# Altium schematic sheet ST_LINK_V2-1.SCHDOC: ST-LINK/V2-1 with support of SWD only
size A4; Date: 01-DEC-2013; Author: A.B; CompanyName: STMicroelectronics; Organization: Microcontrollers Division; Address1: 12, Rue Jules HOROWITZ; Address2: 38019 Grenoble; Address3: FRANCE; DocumentNumber: MB1184; Revision: C-01; SheetNumber: 2; SheetTotal: 10; Project: STM32L476G-DISCO
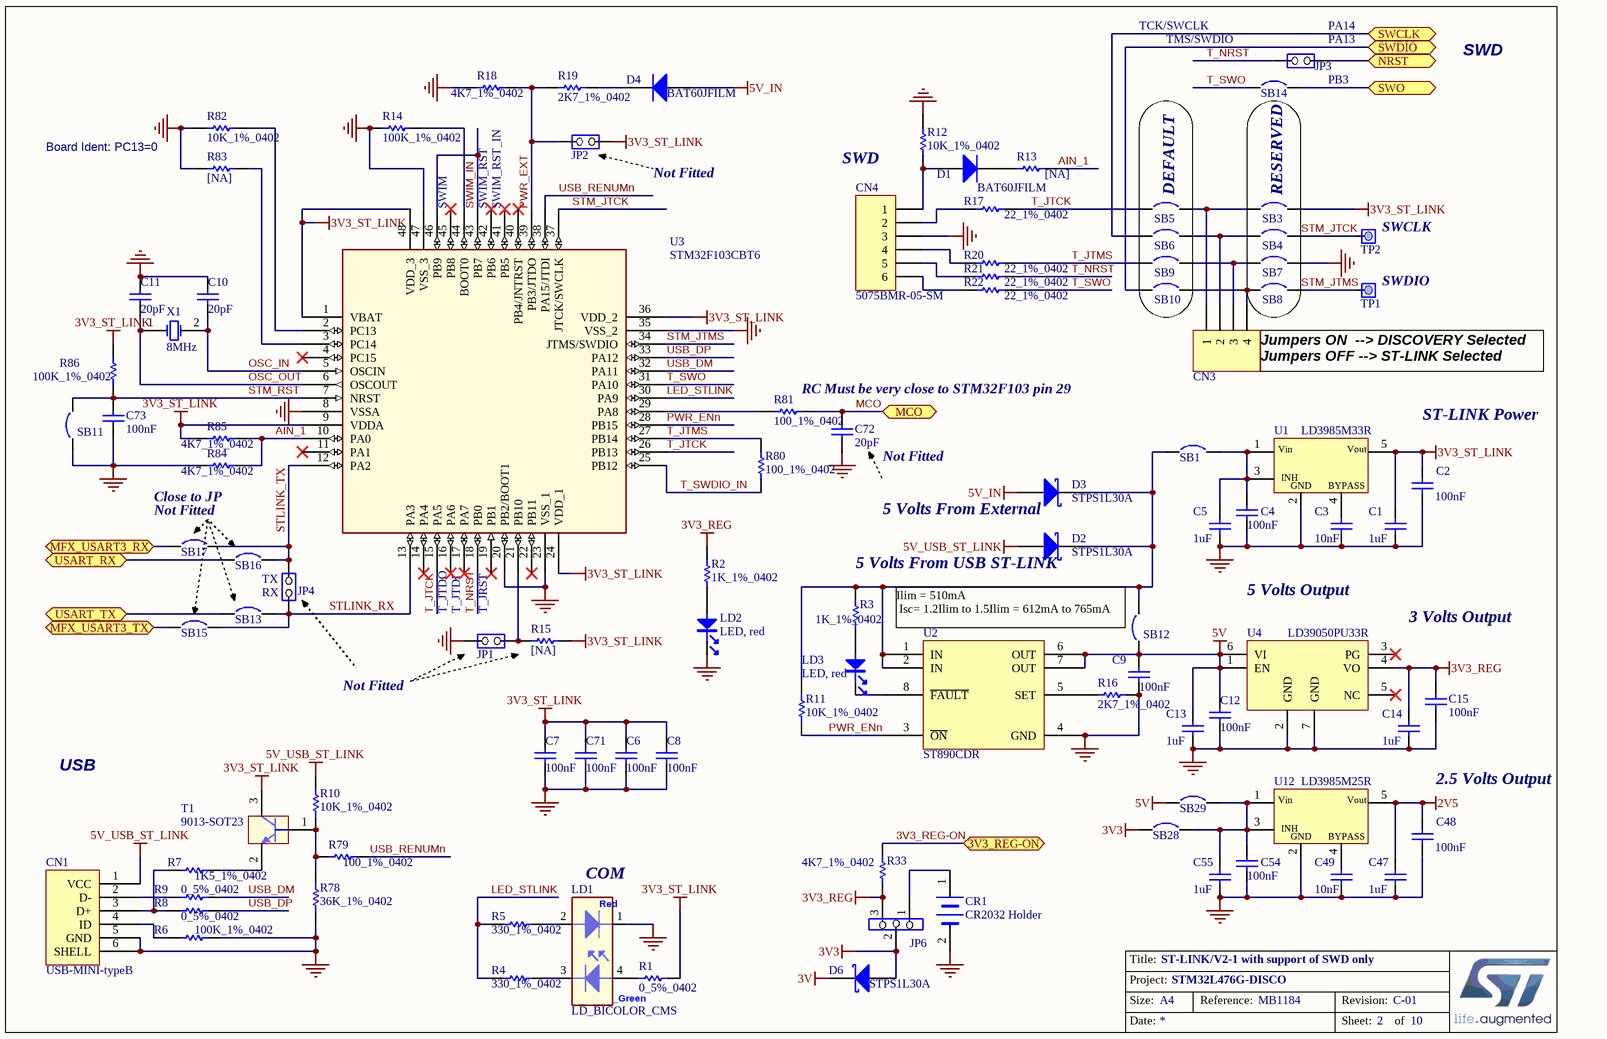
[diagram p0: ST_LINK_V2-1.SCHDOC]

## Parts
C1  1uF  [0603C]
C2  100nF  [0402C]
C3  10nF  [0603C]
C4  100nF  [0402C]
C5  1uF  [0603C]
C6  100nF  [0402C]
C7  100nF  [0402C]
C8  100nF  [0402C]
C9  100nF  [0402C]
C10  20pF  [0402C]
C11  20pF  [0402C]
C12  100nF  [0402C]
C13  1uF  [0603C]
C14  1uF  [0603C]
C15  100nF  [0402C]
C47  1uF  [0603C]
C48  100nF  [0402C]
C49  10nF  [0603C]
C54  100nF  [0402C]
C55  1uF  [0603C]
C71  100nF  [0402C]
C72  20pF  [0402C]
C73  100nF  [0402C]
CN1  USB-MINI-typeB  [USB-MINI-B-SMD]
CN3  Header 4  [Header 4]  (value not drawn)
CN4  5075BMR-05-SM  [HDR1X6]
CR1  CR2032 Holder  [CR2032/SMT]
D1  BAT60JFILM  [SOD323/A]
D2  STPS1L30A  [SMA]
D3  STPS1L30A  [SMA]
D4  BAT60JFILM  [SOD323/A]
D6  STPS1L30A  [SMA]
JP1  Jumper 2 pins  [SIP2/2.54]  (value not drawn)
JP2  Jumper 2 pins  [SIP2/2.54]  (value not drawn)
JP3  Jumper 2 pins  [SIP2/2.54]  (value not drawn)
JP4  Jumper 2 pins  [SIP2/2.54]  (value not drawn)
JP6  Jumper 3 pins  [SIP3]  (value not drawn)
LD1  LD_BICOLOR_CMS  [HSMF-A201]
LD2  LED, red  [0603D]
LD3  LED, red  [0603D]
R1  0_5%_0402  [0402R]
R2  1K_1%_0402  [0402R]
R3  1K_1%_0402  [0402R]
R4  330_1%_0402  [0402R]
R5  330_1%_0402  [0402R]
R6  100K_1%_0402  [0402R]
R7  1K5_1%_0402  [0402R]
R8  0_5%_0402  [0402R]
R9  0_5%_0402  [0402R]
R10  10K_1%_0402  [0402R]
R11  10K_1%_0402  [0402R]
R12  10K_1%_0402  [0402R]
R13  [NA]  [0402R]
R14  100K_1%_0402  [0402R]
R15  [NA]  [0402R]
R16  2K7_1%_0402  [0402R]
R17  22_1%_0402  [0402R]
R18  4K7_1%_0402  [0402R]
R19  2K7_1%_0402  [0402R]
R20  22_1%_0402  [0402R]
R21  22_1%_0402  [0402R]
R22  22_1%_0402  [0402R]
R33  4K7_1%_0402  [0402R]
R78  36K_1%_0402  [0402R]
R79  100_1%_0402  [0402R]
R80  100_1%_0402  [0402R]
R81  100_1%_0402  [0402R]
R82  10K_1%_0402  [0402R]
R83  [NA]  [0402R]
R84  4K7_1%_0402  [0402R]
R85  4K7_1%_0402  [0402R]
R86  100K_1%_0402  [0402R]
SB1  Circuit Breaker  [JP2_SMD]  (value not drawn)
SB3  Circuit Breaker  [JP2_SMD]  (value not drawn)
SB4  Circuit Breaker  [JP2_SMD]  (value not drawn)
SB5  Circuit Breaker  [JP2_SMD]  (value not drawn)
SB6  Circuit Breaker  [JP2_SMD]  (value not drawn)
SB7  Circuit Breaker  [JP2_SMD]  (value not drawn)
SB8  Circuit Breaker  [JP2_SMD]  (value not drawn)
SB9  Circuit Breaker  [JP2_SMD]  (value not drawn)
SB10  Circuit Breaker  [JP2_SMD]  (value not drawn)
SB11  Circuit Breaker  [JP2_SMD]  (value not drawn)
SB12  Circuit Breaker  [JP2_SMD]  (value not drawn)
SB13  Circuit Breaker  [JP2_SMD]  (value not drawn)
SB14  Circuit Breaker  [JP2_SMD]  (value not drawn)
SB15  Circuit Breaker  [JP2_SMD]  (value not drawn)
SB16  Circuit Breaker  [JP2_SMD]  (value not drawn)
SB17  Circuit Breaker  [JP2_SMD]  (value not drawn)
SB28  Circuit Breaker  [JP2_SMD]  (value not drawn)
SB29  Circuit Breaker  [JP2_SMD]  (value not drawn)
T1  9013-SOT23  [SOT23]
TP1  Test point 1 pin with hole  [SIP1/2.54]  (value not drawn)
TP2  Test point 1 pin with hole  [SIP1/2.54]  (value not drawn)
U1  LD3985M33R  [SOT-23-5L]
U2  ST890CDR  [SO-8]
U3  STM32F103CBT6  [QFP48 7x7]
U4  LD39050PU33R  [DFN6_3x3]
U12  LD3985M25R  [SOT-23-5L]
X1  8MHz  [XTAL1]

## Blocks framed on the sheet
DEFAULT: SB5 SB6 SB9 SB10
RESERVED: SB3 SB4 SB7 SB8

## Ports
3V3_REG-ON, MCO, MFX_USART3_RX, MFX_USART3_TX, NRST, SWCLK, SWDIO, SWO, USART_RX, USART_TX

## Nets
2V5: C47.1 C48.2 U12.5(Vout)
3V: D6.2(K)
3V3: D6.1(A) JP6.2 SB28.1
3V3_REG: C14.2 C15.2 JP6.3 R2.2 R33.1 U4.4(VO)
3V3_ST_LINK: C1.1 C2.2 C6.1 C7.2 C8.2 C71.2 JP2.2(NO) R1.2 R15.2 R85.1 R86.2 SB3.2 T1.3(C) U1.5(Vout) U3.1(VBAT) U3.9(VDDA) U3.24(VDD_1) U3.36(VDD_2) U3.48(VDD_3)
5V: C9.2 C12.2 C13.2 SB12.1 SB29.1 U2.6(OUT) U2.7(OUT) U4.1(EN) U4.6(VI)
5V_IN: D3.1(A) D4.1(A)
5V_USB_ST_LINK: CN1.1(VCC) D2.1(A) R10.2
GND: C1.2 C2.1 C3.1 C4.1 C5.1 C6.2 C7.1 C8.1 C9.1 C10.1 C11.1 C12.1 C13.1 C14.1 C15.1 C47.2 C48.1 C49.1 C54.1 C55.1 C71.1 C72.2 C73.1 CN1.5(GND) CN1.6(SHELL) CN4.3 CR1.2(-) JP1.1(COMMON) LD1.1 LD2.2 R6.2 R12.2 R14.1 R16.2 R18.1 R78.1 R82.1 R83.1 R84.1 SB7.2 SB11.1 U1.2(GND) U2.4(GND) U3.8(VSSA) U3.20(PB2/BOOT1) U3.23(VSS_1) U3.35(VSS_2) U3.47(VSS_3) U4.2(GND) U4.7(GND) U12.2(GND)
3V3_REG-ON: R33.2 ; port 3V3_REG-ON
AIN_1: R13.2 R84.2 R85.2 U3.10(PA0)
LED_STLINK: R4.1 R5.1 U3.30(PA9)
MCO: C72.1 R81.2 ; port MCO
MFX_USART3_RX: SB17.1 ; port MFX_USART3_RX
MFX_USART3_TX: SB15.1 ; port MFX_USART3_TX
NRST: JP3.2(NO) ; port NRST
OSC_IN: C10.2 U3.5(OSCIN) X1.2(OSC2)
OSC_OUT: C11.2 U3.6(OSCOUT) X1.1(OSC1)
PWR_ENn: R11.1 U2.3(~{ON}) U3.28(PB15)
PWR_EXT: JP2.1(COMMON) R18.2 R19.1 U3.39(PB3/JTDO)
STLINK_RX: JP4.1(COMMON) SB13.2 SB15.2 U3.13(PA3)
STLINK_TX: JP4.2(NO) SB16.2 SB17.2 U3.12(PA2)
STM_JTCK: SB4.2 TP2.1(COMMON) U3.37(JTCK/SWCLK)
STM_JTMS: SB8.2 TP1.1(COMMON) U3.34(JTMS/SWDIO)
STM_RST: C73.2 R86.1 SB11.2 U3.7(NRST)
SWCLK: SB6.1 ; port SWCLK
SWDIO: SB10.1 ; port SWDIO
SWIM_IN: U3.43(PB7) U3.46(PB9)
SWO: SB14.2 ; port SWO
T_JTCK: R17.2 SB5.1 U3.15(PA5) U3.26(PB13)
T_JTMS: R20.2 R80.2 SB9.1 U3.27(PB14)
T_NRST: JP3.1(COMMON) R21.2 U3.18(PB0)
T_SWDIO_IN: R80.1 U3.25(PB12)
T_SWO: R22.2 SB14.1 U3.31(PA10)
USART_RX: SB16.1 ; port USART_RX
USART_TX: SB13.1 ; port USART_TX
USB_DM: R9.2 U3.32(PA11)
USB_DP: R8.2 U3.33(PA12)
USB_RENUMn: R79.2 U3.38(PA15/JTDI)
NetC3_2: C3.2 U1.4(BYPASS)
NetC4_2: C4.2 C5.2 SB1.2 U1.1(Vin) U1.3(CE)
NetC49_2: C49.2 U12.4(BYPASS)
NetC54_2: C54.2 C55.2 SB28.2 SB29.2 U12.1(Vin) U12.3(CE)
NetCN1_2: CN1.2(D-) R9.1
NetCN1_3: CN1.3(D+) R7.1 R8.1
NetCN1_4: CN1.4(ID) R6.1
NetCN3_1: CN3.1 SB3.1 SB5.2
NetCN3_2: CN3.2 SB4.1 SB6.2
NetCN3_3: CN3.3 SB7.1 SB9.2
NetCN3_4: CN3.4 SB8.1 SB10.2
NetCN4_1: CN4.1 D1.1(A) R12.1
NetCN4_2: CN4.2 R17.1
NetCN4_4: CN4.4 R20.1
NetCN4_5: CN4.5 R21.1
NetCN4_6: CN4.6 R22.1
NetCR1_1: CR1.1(+) JP6.1
NetD1_2: D1.2(K) R13.1
NetD2_2: D2.2(K) D3.2(K) R3.2 R11.2 SB1.1 SB12.2 U2.1(IN) U2.2(IN)
NetD4_2: D4.2(K) R19.2
NetJP1_2: JP1.2(NO) R15.1 U3.21(PB10)
NetLD1_2: LD1.2 R5.2
NetLD1_3: LD1.3 R4.2
NetLD1_4: LD1.4 R1.1
NetLD2_1: LD2.1 R2.1
NetLD3_1: LD3.1 R3.1
NetLD3_2: LD3.2 U2.8(~{FAULT})
NetR7_2: R7.2 T1.2(E)
NetR10_1: R10.1 R78.2 R79.1 T1.1(B)
NetR14_2: R14.2 U3.44(BOOT0)
NetR16_1: R16.1 U2.5(SET)
NetR81_1: R81.1 U3.29(PA8)
NetR82_2: R82.2 U3.2(PC13)
NetR83_2: R83.2 U3.3(PC14)

Not connected (* = marked no-connect by the designer): U3 4(PC15)* 11(PA1)* 14(PA4)* 16(PA6)* 17(PA7)* 19(PB1)* 22(PB11)* 40(PB4/JNTRST)* 41(PB5)* 42(PB6)* 45(PB8)*; U4 3(PG)* 5(NC)*

## Notes on the sheet
- TCK/SWCLK
- TMS/SWDIO
- (near JP3) PA14
- (near JP3) PA13
- PB3
- SWD
- Board Ident: PC13=0
- Not Fitted
- SWIM
- (near U3) SWIM_RST
- SWIM_RST_IN
- (near TP2) SWCLK
- (near TP1) SWDIO
- (near CN3) Jumpers ON  --> DISCOVERY Selected
  Jumpers OFF --> ST-LINK Selected
- (near R81) RC Must be very close to STM32F103 pin 29
- ST-LINK Power
- Close to JP
- (near C72) Not Fitted
- (near D3) 5 Volts From External
- TX
- (near D2) 5 Volts From USB ST-LINK
- RX
- T_JTDO
- T_JTDI
- T_JRST
- (near SB12) Ilim = 510mA
  Isc= 1.2Ilim to 1.5Ilim = 612mA to 765mA
- 5 Volts Output
- 3 Volts Output
- USB
- 2.5 Volts Output
- (near LD1) COM
- Title:
- Project:
- Size:
- Date:
- A4
- Reference:
- Sheet:
- Revision:
- of
- (in symbol LD3985M25R) INH
- (in symbol LD3985M33R) INH
- (in symbol LD_BICOLOR_CMS) Red; _Green

## Library data of the parts
C1 C5 C13 C14 C47 C55 = Cap_1uF_X5R_10%_0603: Capacitor,1uF,16V,X5R,10%,0603,YAGEO; Manuf_Part_1: CC0603KRX5R7BB105; Revision: July-2002: Re-released for DXP Platform.; Value: 1uF; Order: CC0603KRX5R7BB105; Manuf_1: YAGEO
C2 C4 C6-C9 C12 C15 C48 C54 C71 C73 = Cap_100nF_X7R_10%_0402: Capacitor,100nF,16V,X7R,10%,0402,YAGEO; Manuf_Part_1: CC0402KRX7R7BB104; Revision: July-2002: Re-released for DXP Platform.; Value: 100nF; Order: CC0402KRX7R7BB104; Manuf_1: YAGEO
C3 C49 = Cap_10nF_X7R_10%_0603: Capacitor,10nF,50V,X7R,10%,0603,YAGEO; Manuf_Part_1: CC0603KRX7R9BB103; Revision: July-2002: Re-released for DXP Platform.; Value: 10nF; Order: CC0603KRX7R9BB103; Manuf_1: YAGEO
C10 C11 = Cap_20pF_NPO_5%_0402: Capacitor,20pF,50V,NPO,5%,0402,YAGEO; Order: CC0402JRNPO9BN200; Revision: July-2002: Re-released for DXP Platform.; Value: 20pF; Manuf_1: YAGEO; Manuf_Part_1: CC0402JRNPO9BN200
C72 = Cap_20pF_NPO_5%_0402: Capacitor,20pF,50V,NPO,5%,0402,YAGEO; Order: CC0402JRNPO9BN200; Fitted: NO; Revision: July-2002: Re-released for DXP Platform.; Value: 20pF; Manuf_1: YAGEO; Manuf_Part_1: CC0402JRNPO9BN200
CN1 = USB-MINI-typeB connector: Manuf_Part_1: 5075BMR-05-SM; Manuf_Part_2: 218205M1110T; Manuf_2: lyconn; Order: 5075BMR-05-SM; ECCN_US/EU: n/a
CN3 = Header 4: Header, 4-Pin; Revision: 17-Jul-2002: Re-released for DXP Platform.; Publisher: Altium Limited; ECCN_US/EU: n/a
CN4 = Header 6: Header, 6-Pin; LatestRevisionDate: 17-Jul-2002; LatestRevisionNote: Re-released for DXP Platform.; Publisher: Altium Limited; ECCN_US/EU: n/a
CR1 = BATT_2032: CR2032 socket, S8421-45R; Manuf_2: Lotes; Manuf_Part_2: KB7410AP2L; Manuf_1: HARWIN; Order: 952-1737-2-ND; ECCN_US/EU: EAR99/NEC; Distrib_2: http://www.bestbattery.co.kr/lotes/lotes.htm; Manuf_Part_1: S8421-45R; Distrib: DIGIKEY
D1 D4 = BAT60JFILM: Manuf_1: STM; Provided: ST; ECCN_US/EU: EAR99/NEC; Ref St: 9151097; Revision: July-2002: Re-released for DXP Platform.; Order: BAT60JFILM; Manuf_Part_1: BAT60JFILM; Distrib: ST
D2 D3 D6 = STPS1L30A: Low Drop power Schottky rectifier; Manuf_1: STM; Provided: ST; Ref St: xxxxxxxx; ECCN_US/EU: EAR99/NEC; Manuf_Part_1: STPS1L30A; Order: STPS1L30A; Distrib: ST
JP1 JP2 JP4 = Jumper2: Fitted: NO; ECCN_US/EU: n/a
JP3 = Jumper2: ECCN_US/EU: n/a
JP6 = Jumper3: ECCN_US/EU: n/a
LD1 = LD_BICOLOR_CMS: Bicolor Led; Manuf_Part_1: HSMF-A201-A00J1; Manuf_1: Avago Technologies; Manuf_2: everluck; Manuf_Part_2: LE-RGW35280; Ref St: xxxxxx; ECCN_US/EU: EAR99/NEC; Distrib: RADIOSPARES
LD2 LD3 = LED_red: LED, red, 0603; Manuf_1: everlight; Manuf_Part_1: 19-213-R6C-AP1Q2B/3T; ECCN_US/EU: EAR99/NEC; Order: 19-213-R6C-AP1Q2B/3T
R1 R8 R9 = Res_0_5%_0402: Resistor,0,0402,5%,YAGEO; Manuf_Part_1: RC0402JR-070RL; Value: 0; Order: 2363467; ECCN_US/EU: n/a; Manuf_1: YAGEO; Distrib: FARNELL
R2 R3 = Res_1K_1%_0402: Resistor,1K,0402,1%,YAGEO; Manuf_Part_1: RC0402FR-071KL; Value: 1K; Manuf_1: YAGEO; Order: RC0402FR-071KL; ECCN_US/EU: n/a
R4 R5 = Res_330_1%_0402: Resistor,330,0402,1%,YAGEO; Manuf_Part_1: RC0402FR-07330RL; Value: 330; ECCN_US/EU: n/a; Manuf_1: YAGEO; Distrib: DIGIKEY; Order: RC0402FR-07330RL
R6 R14 R86 = Res_100K_1%_0402: Resistor,100K,0402,1%,YAGEO; Manuf_Part_1: RT0402FRE07100KL; Value: 100K; Manuf_1: YAGEO; Order: RT0402FRE07100KL; ECCN_US/EU: n/a
R7 = Res_1K5_1%_0402: Resistor,1K5,0402,1%,YAGEO; Manuf_Part_1: RC0402FR-071K5L; Value: 1K5; Manuf_1: YAGEO; Order: RC0402FR-071K5L; ECCN_US/EU: n/a; Distrib: FARNELL
R10-R12 R82 = Res_10K_1%_0402: Resistor,10K,0402,1%,YAGEO; Manuf_Part_1: RC0402FR-0710KL; Value: 10K; Manuf_1: YAGEO; Order: RC0402FR-0710KL; ECCN_US/EU: n/a
R13 R15 R83 = Res_NA_0402: Resistor,[NA],0402; Fitted: NO; Value: [NA]; ECCN_US/EU: n/a
R16 R19 = Res_2K7_1%_0402: Resistor,2K7,0402,1%,YAGEO; Manuf_Part_1: RC0402FR-072K7L; Value: 2K7; Manuf_1: YAGEO; Order: RC0402FR-072K7L; ECCN_US/EU: n/a; Distrib: FARNELL
R17 R20-R22 = Res_22_1%_0402: Resistor,22,0402,1%,YAGEO; Manuf_Part_1: RC0402FR-0722RL; Value: 22; Manuf_1: YAGEO; Order: RC0402FR-0722RL; ECCN_US/EU: n/a; Distrib: FARNELL
R18 R33 R84 R85 = Res_4K7_1%_0402: Resistor,4K7,0402,1%,YAGEO; Manuf_Part_1: RT0402FRE074K7L; Value: 4K7; Manuf_1: YAGEO; Order: RT0402FRE074K7L; ECCN_US/EU: n/a
R78 = Res_36K_1%_0402: Resistor,36K,0402,1%,YAGEO; Manuf_Part_1: RC0402FR-0736KL; Value: 36K; Manuf_1: YAGEO; Order: RC0402FR-0736KL; ECCN_US/EU: n/a; Distrib: FARNELL
R79-R81 = Res_100_1%_0402: Resistor,100,0402,1%,YAGEO; Manuf_Part_1: RC0402FR-07100RL; Value: 100; Order: 9239111; Manuf_1: YAGEO; ECCN_US/EU: n/a; Distrib: FARNELL
SB1 SB5 SB6 SB9 SB10 SB13 SB16 SB28 = Circuit Breaker: Solder: YES; Revision: July-2002: Re-released for DXP Platform.
SB3 SB4 SB7 SB8 SB11 SB12 SB14 SB15 SB17 SB29 = Circuit Breaker: Solder: NO; Revision: July-2002: Re-released for DXP Platform.
T1 = 9013-SOT23: NPN Bipolar Transistor; Manuf_1: NXP; Manuf_Part_1: BSR14; Order: 1081310; ECCN_US/EU: EAR99/NEC; Revision: July-2002: Re-released for DXP Platform.; Distrib: FARNELL
TP1 TP2 = TP1: Test Point; Fitted: NO; ECCN_US/EU: n/a
U1 = LD3985M33R: Ultra low drop-low noise BiCMOS voltage, regulators low ESR capacitors compatible; Manuf_1: STM; Provided: ST; Ref St: 9176161; ECCN_US/EU: EAR99/NEC; Manuf_Part_1: LD3985M33R; Distrib: ST; Order: LD3985M33R
U2 = ST890CDR: 1.2 A current limited high-side power switch with thermal shutdown; Manuf_1: STM; ECCN_US/EU: EAR99/NEC; Provided: ST; Manuf_Part_1: ST890CDR; Distrib: ST
U3 = STM32F103CBT6: Medium-density performance line ARM-based 32-bit MCU with 128KB Flash; Manuf_1: STM; Ref St: xxxxxxxx; Provided: ST; ECCN_US/EU: 3A991A2/NEC; Footprint: QFP48 7X7; Manuf_Part_1: STM32F103CBT6; Order: STM32F103CBT6; Distrib: ST
U4 = LD39050P: Ultra low drop-low , 500 mA low quiescent current; Manuf_1: STM; Provided: ST; ECCN_US/EU: EAR99/NEC; Ref St: xxxxxxxx; Distrib: ST; Manuf_Part_1: LD39050PU33R; Order: LD39050PU33R
U12 = LD3985M25R: Ultra low drop-low noise BiCMOS voltage, regulators low ESR capacitors compatible; Manuf_1: STM; Provided: ST; Ref St: 9176007; ECCN_US/EU: EAR99/NEC; Manuf_Part_1: LD3985M25R; Order: LD3985M25R; Distrib: ST
X1 = XTAL_8MHZ_20PPM: Crystal Oscillator,8Mhz,20PF,20PPM,-10-70 degree,DIP,HC-49S; Manuf_Part_1: HC-49S-C20QSA-8.000MHZ; ECCN_US/EU: EAR99/NEC; Order: HC-49S-C20QSA-8.000MHZ